# EAGLE design Front MCN Breakout (EAGLE 5.12)
PARTNO: RC0603JR-1010KL

## Sheet 1 of 3
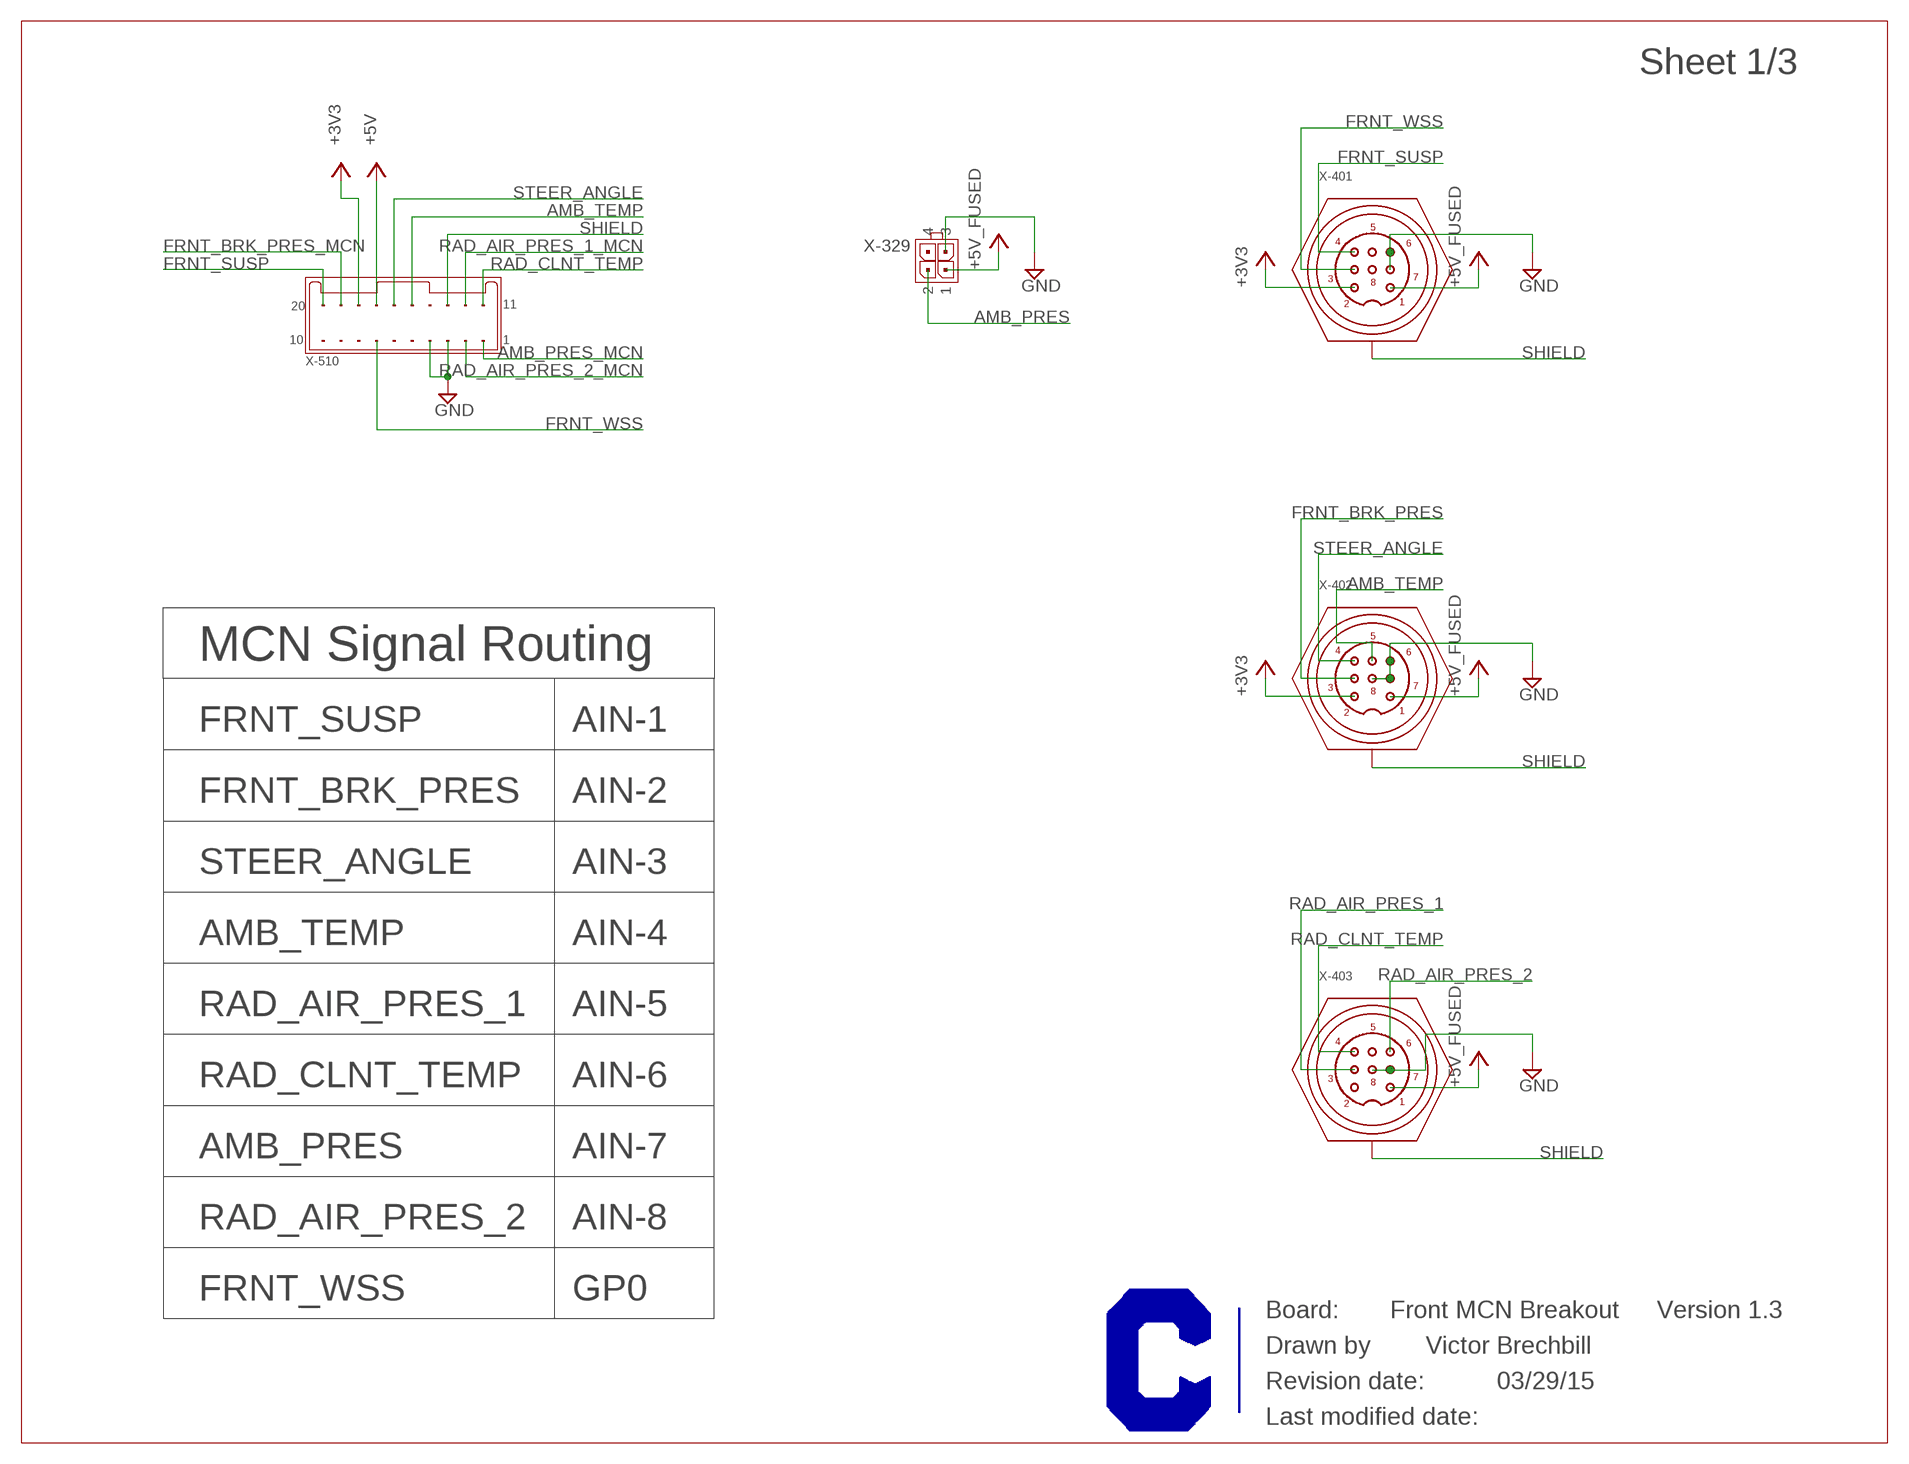
[diagram p0: schematic, sheet 1]

### Parts
U$1  CURRENT-C-LETTER-LANDSCAPE  [BLANK]
X-329  MICROFIT-04-DUAL-VERT-SMD  [MICROFIT-4-DUAL-VERT-SMD]
X-401  M8-8  [M8-VERT-8POS]
X-402  M8-8  [M8-VERT-8POS]
X-403  M8-8  [M8-VERT-8POS]
X-510  MICROCLASP-20-DUAL-RA  [MICROCLASP-20-DUAL-RA]

### Nets
+3V3: X-401.P$2 X-402.P$2 X-510.18 ; also sheet 2
+5V: X-510.17 ; also sheet 2
+5V_FUSED: X-329.1 X-401.P$1 X-402.P$1 X-403.P$1 ; also sheet 2
AMB_PRES: X-329.2 ; also sheet 2
AMB_PRES_MCN: X-510.1 ; also sheet 2
AMB_TEMP: X-402.P$5 X-510.15 ; also sheet 2
FRNT_BRK_PRES: X-402.P$3 ; also sheet 2
FRNT_BRK_PRES_MCN: X-510.19 ; also sheet 2
FRNT_SUSP: X-401.P$4 X-510.20
FRNT_WSS: X-401.P$3 X-510.7 ; also sheet 2
GND: X-329.3 X-401.P$6 X-401.P$7 X-402.P$6 X-402.P$7 X-402.P$8 X-403.P$7 X-403.P$8 X-510.3 X-510.4 ; also sheet 2
RAD_AIR_PRES_1: X-403.P$3 ; also sheet 2
RAD_AIR_PRES_1_MCN: X-510.12 ; also sheet 2
RAD_AIR_PRES_2: X-403.P$6 ; also sheet 2
RAD_AIR_PRES_2_MCN: X-510.2 ; also sheet 2
RAD_CLNT_TEMP: X-403.P$4 X-510.11 ; also sheet 2
SHIELD: X-401.SHLD(SHIELD) X-402.SHLD(SHIELD) X-403.SHLD(SHIELD) X-510.13
STEER_ANGLE: X-402.P$4 X-510.16
Unconnected: X-329.4 X-401.P$5 X-401.P$8 X-403.P$2 X-403.P$5 X-510.5 X-510.6 X-510.8 X-510.9 X-510.10 X-510.14

### Notes on the sheet
- MCN Signal Routing
- FRNT_SUSP | AIN-1
- FRNT_BRK_PRES | AIN-2
- STEER_ANGLE | AIN-3
- AMB_TEMP | AIN-4
- RAD_AIR_PRES_1 | AIN-5
- RAD_CLNT_TEMP | AIN-6
- AMB_PRES | AIN-7
- RAD_AIR_PRES_2 | AIN-8
- FRNT_WSS | GP0
- Front MCN Breakout | Version 1.3
- Victor Brechbill
- 03/29/15

## Sheet 2 of 3
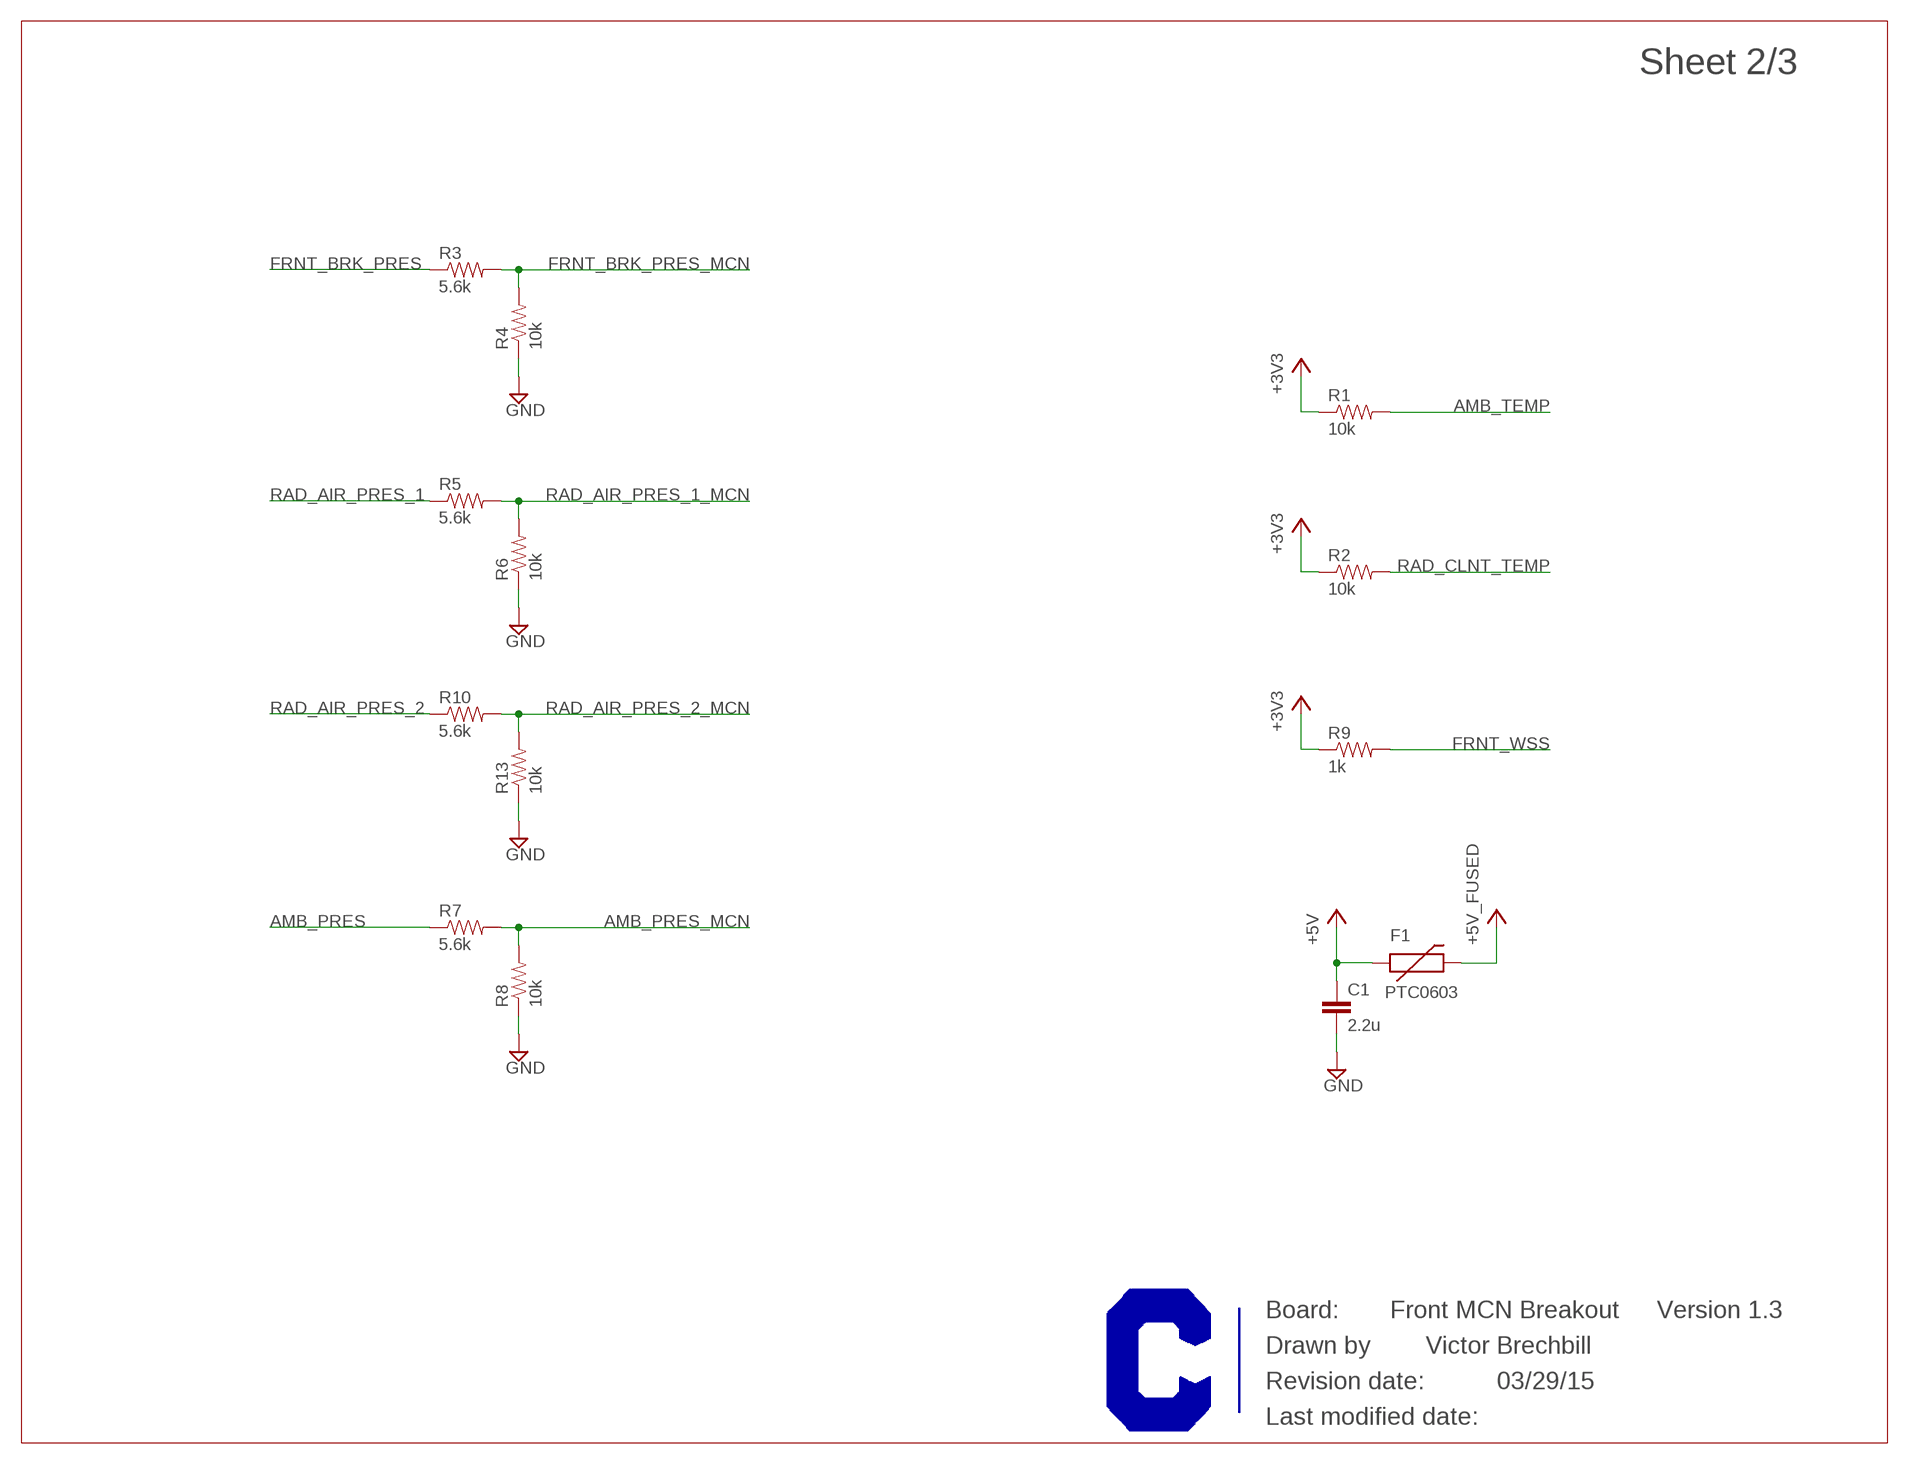
[diagram p1: schematic, sheet 2]

### Parts
C1  2.2u  CAP0603-CAP  [0603-CAP]
F1  PTC0603  [0603]
R1  10k  RESISTOR0603-RES  [0603-RES]
R2  10k  RESISTOR0603-RES  [0603-RES]
R3  5.6k  RESISTOR0603-RES  [0603-RES]
R4  10k  RESISTOR0603-RES  [0603-RES]
R5  5.6k  RESISTOR0603-RES  [0603-RES]
R6  10k  RESISTOR0603-RES  [0603-RES]
R7  5.6k  RESISTOR0603-RES  [0603-RES]
R8  10k  RESISTOR0603-RES  [0603-RES]
R9  1k  RESISTOR0603-RES  [0603-RES]
R10  5.6k  RESISTOR0603-RES  [0603-RES]
R13  10k  RESISTOR0603-RES  [0603-RES]
U$2  CURRENT-C-LETTER-LANDSCAPE  [BLANK]

### Nets
+3V3: R1.1 R2.1 R9.1 ; also sheet 1
+5V: C1.1 F1.1 ; also sheet 1
+5V_FUSED: F1.2 ; also sheet 1
AMB_PRES: R7.1 ; also sheet 1
AMB_PRES_MCN: R7.2 R8.2 ; also sheet 1
AMB_TEMP: R1.2 ; also sheet 1
FRNT_BRK_PRES: R3.1 ; also sheet 1
FRNT_BRK_PRES_MCN: R3.2 R4.2 ; also sheet 1
FRNT_WSS: R9.2 ; also sheet 1
GND: C1.2 R4.1 R6.1 R8.1 R13.1 ; also sheet 1
RAD_AIR_PRES_1: R5.1 ; also sheet 1
RAD_AIR_PRES_1_MCN: R5.2 R6.2 ; also sheet 1
RAD_AIR_PRES_2: R10.1 ; also sheet 1
RAD_AIR_PRES_2_MCN: R10.2 R13.2 ; also sheet 1
RAD_CLNT_TEMP: R2.2 ; also sheet 1

### Notes on the sheet
- Front MCN Breakout | Version 1.3
- Victor Brechbill
- 03/29/15

## Sheet 3 of 3
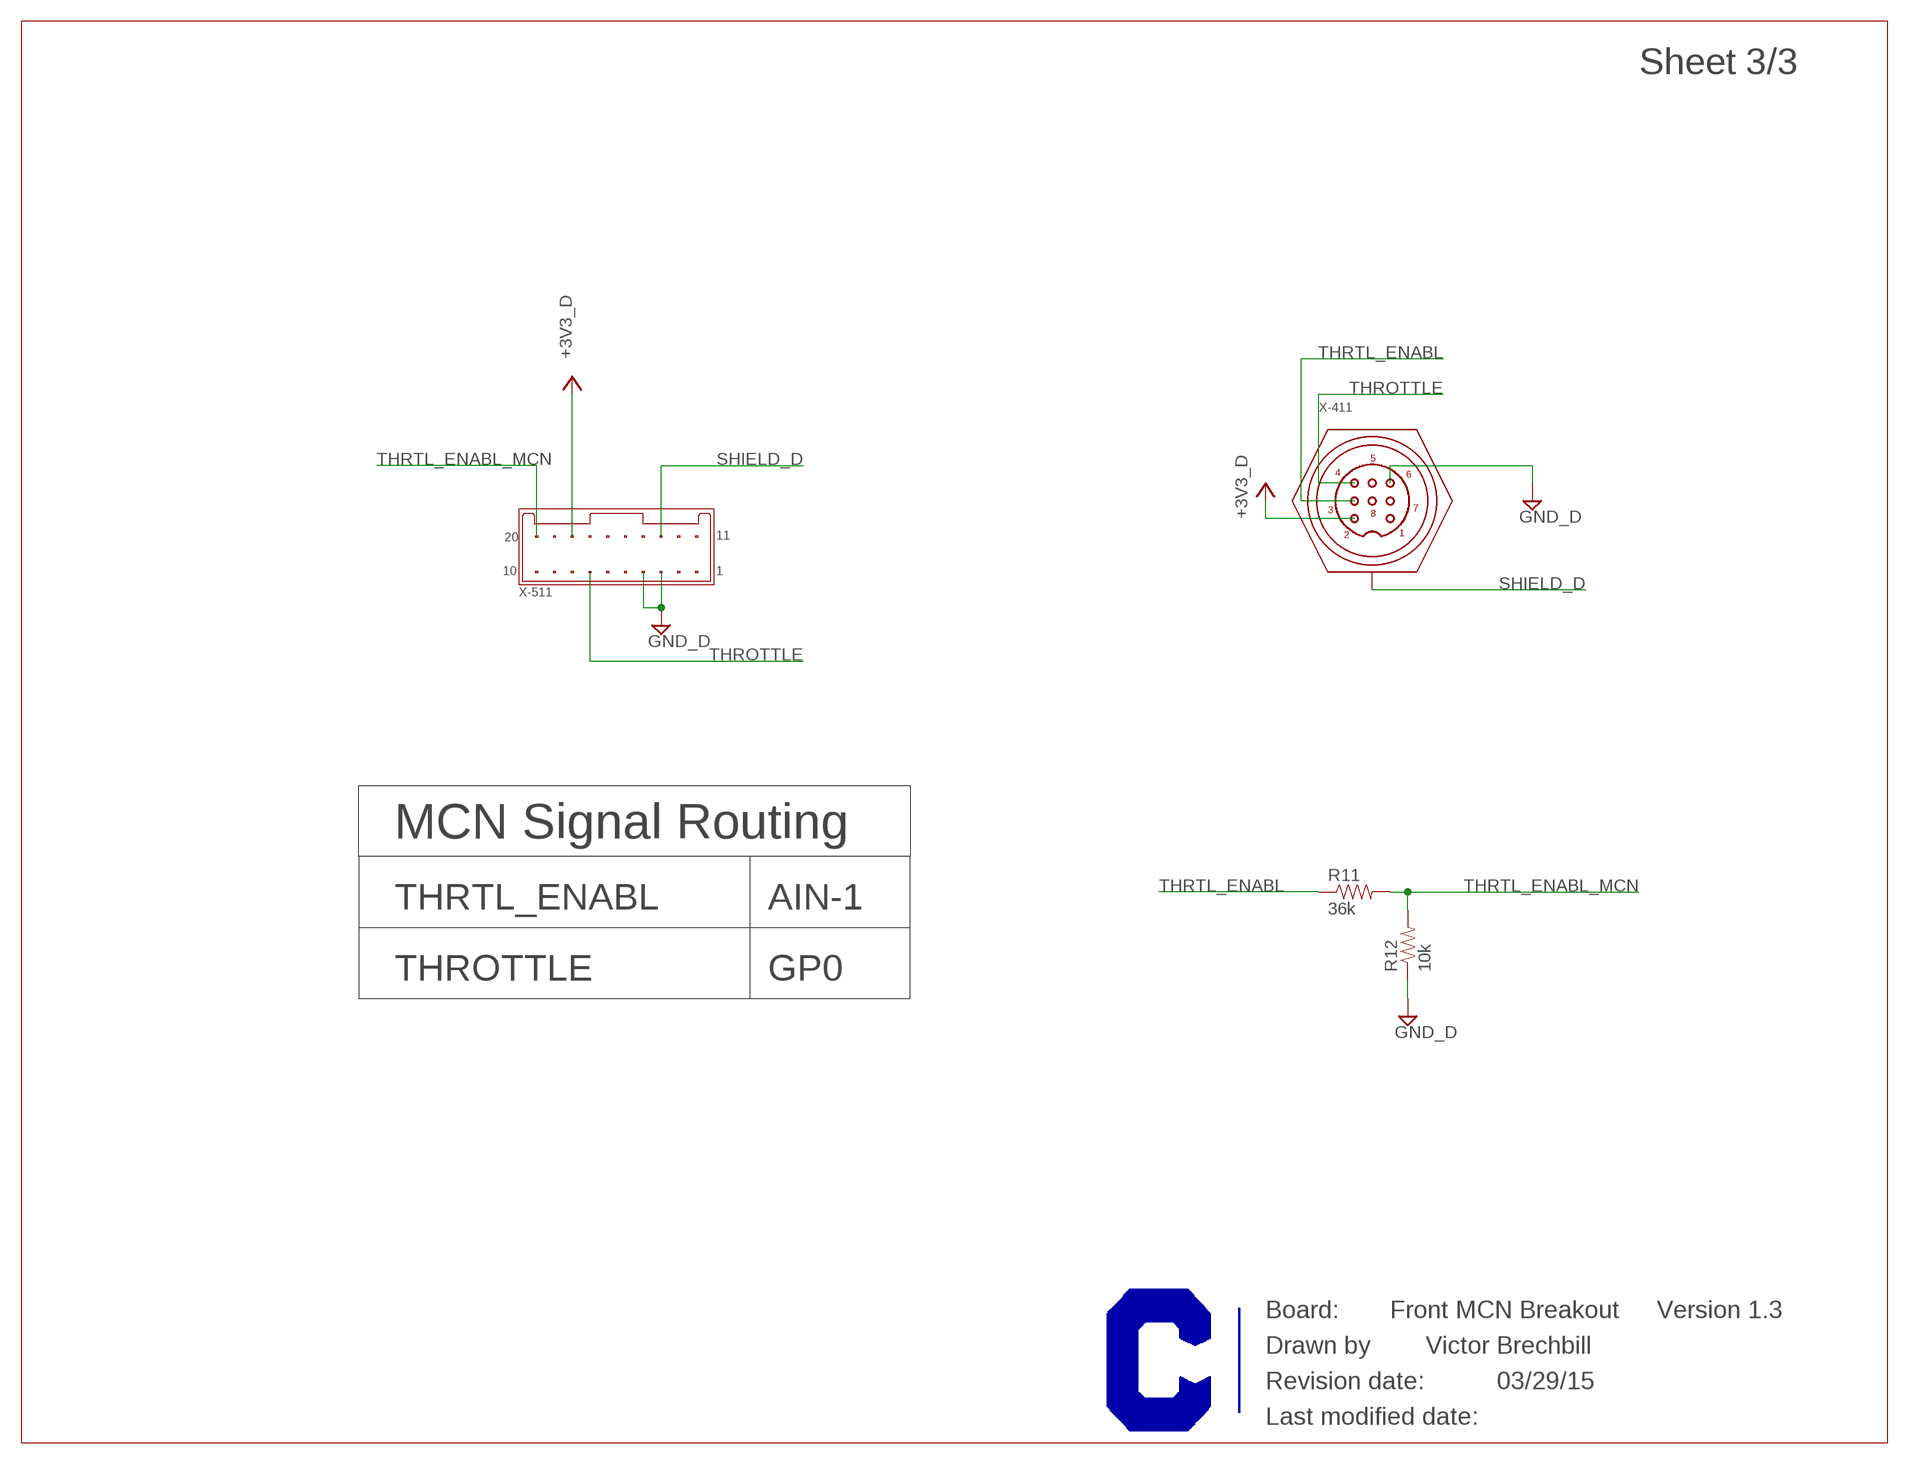
[diagram p2: schematic, sheet 3]

### Parts
R11  36k  RESISTOR0603-RES  [0603-RES]
R12  10k  RESISTOR0603-RES  [0603-RES]
U$3  CURRENT-C-LETTER-LANDSCAPE  [BLANK]
X-411  M8-8  [M8-VERT-8POS]
X-511  MICROCLASP-20-DUAL-RA  [MICROCLASP-20-DUAL-RA]

### Nets
+3V3_D: X-411.P$2 X-511.18
GND_D: R12.1 X-411.P$6 X-511.3 X-511.4
SHIELD_D: X-411.SHLD(SHIELD) X-511.13
THROTTLE: X-411.P$4 X-511.7
THRTL_ENABL: R11.1 X-411.P$3
THRTL_ENABL_MCN: R11.2 R12.2 X-511.20
Unconnected: X-411.P$1 X-411.P$5 X-411.P$7 X-411.P$8 X-511.1 X-511.2 X-511.5 X-511.6 X-511.8 X-511.9 X-511.10 X-511.11 X-511.12 X-511.14 X-511.15 X-511.16 X-511.17 X-511.19

### Notes on the sheet
- MCN Signal Routing
- THRTL_ENABL | AIN-1
- THROTTLE | GP0
- Front MCN Breakout | Version 1.3
- Victor Brechbill
- 03/29/15

## Library data of the parts
C1 = SparkFun:CAP: Capacitor Standard 0603 ceramic capacitor, and 0.1" leaded capacitor.
F1 = SparkFun:PTC: Resettable Fuse PTC Resettable Fuse. Spark Fun Electronics SKU : COM-08357
R1-R13 = SparkFun:RESISTOR: Resistor Basic schematic elements and footprints for 0603, 1206, and PTH resistors.
U$1-U$3 = Frames:CURRENT-C-LETTER-LANDSCAPE; BOM: EXCLUDE
X-329 = Molex:MICROFIT-04-DUAL: Molex MicroFit 3.00mm Pitch Header, Surface Mount, Dual Row, 4 Circuits Molex P/N: 43045-0609 (vert) Drawing: http://www.molex.com/pdm_docs/sd/430450418_sd.pdf (vert) Information: http://www.molex.com/molex/products/datasheet.jsp?part=active/0430450418_PCB_HEADERS.xml (vert)
X-401-X-403 X-411 = Conec:M8-8
X-510 X-511 = Molex:MICROCLASP-20-DUAL

## Board
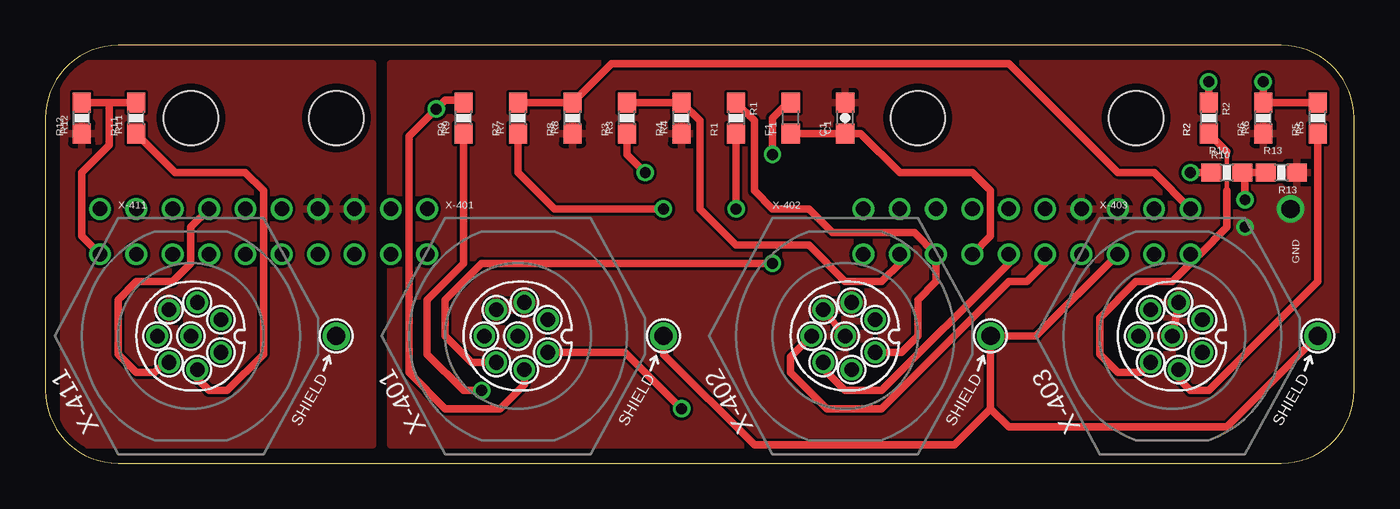
[diagram p3: board, top side]
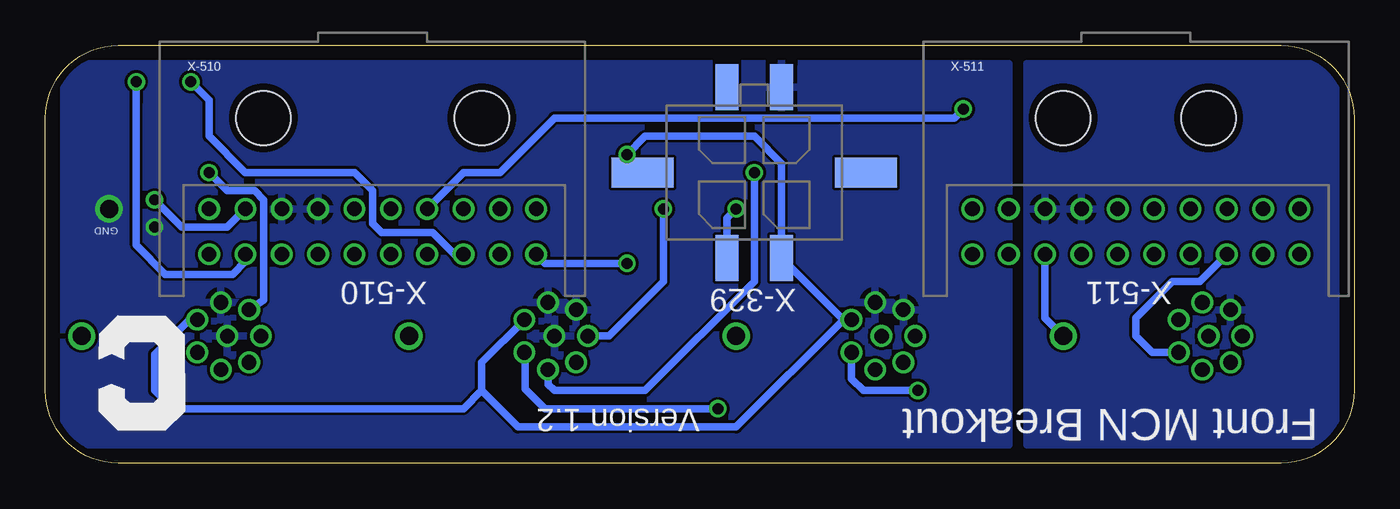
[diagram p4: board, bottom side, seen from below]

Size 72 x 23 mm. Coordinates in mm from the lower left corner, seen from the top.
Outline: 68,0 arc90 72,4 72,19 arc90 68,23 4,23 arc90 0,19 0,4 arc90 4,0 68,0
Copper layers (1*16): Top 0.0356mm / dielectric 1.5011mm / Bottom 0.0356mm
Design rules "OSH Park 2-layer": minimum track width 6mil, minimum drill 13mil, track to track 6mil, track to pad 6mil, pad to pad 6mil, via to via 6mil, smd to smd 6mil, copper to edge 15mil, drill to drill 6mil, minimum pad ring 7mil, minimum via ring 7mil, stop-mask expansion 4mil, vias tented up to drill 25mil, thermal gap 10mil
Holes 3 mm at 60,19 48,19 8,19 16,19

### Footprints (pad centres in the part's own frame; a part is rotated, then mirrored left to right if it is on the bottom)
0603-CAP = smd 1.1 x 1: 1 -0.85,0; 2 0.85,0
0603 = smd 1.1 x 1: 1 -0.85,0; 2 0.85,0
0603-RES = smd 1.1 x 1: 1 -0.85,0; 2 0.85,0
MICROFIT-4-DUAL-VERT-SMD = smd 1.27 x 2.54: 1 1.5,-4.699; 2 -1.5,-4.699; 3 1.5,4.699; 4 -1.5,4.699 | smd 3.43 x 1.65: 5 6.147,0; 6 -6.147,0
M8-VERT-8POS = drill 0.8 round: P$1 1.65,0.9; P$2 1.65,-0.9; P$3 0.35,-1.85; P$4 -1.2,-1.45; P$5 -1.85,0; P$6 -1.2,1.45; P$7 0.35,1.85; P$8 0,0 | drill 1 round: SHLD 8,0
MICROCLASP-20-DUAL-RA = drill 0.8 round: 1 -9,0; 2 -7,0; 3 -5,0; 4 -3,0; 5 -1,0; 6 1,0; 7 3,0; 8 5,0; 9 7,0; 10 9,0; 11 -9,-2.5; 12 -7,-2.5; 13 -5,-2.5; 14 -3,-2.5; 15 -1,-2.5; 16 1,-2.5; 17 3,-2.5; 18 5,-2.5; 19 7,-2.5; 20 9,-2.5

### Placement (x,y rotation side)
C1  44,19 90 top
F1  41,19 90 top
R1  38,19 270 top
R2  64,19 270 top
R3  32,19 90 top
R4  35,19 90 top
R5  70,19 90 top
R6  67,19 90 top
R7  26,19 90 top
R8  29,19 90 top
R9  23,19 90 top
R10  65,16 0 top
R11  5,19 90 top
R12  2,19 90 top
R13  68,16 180 top
U$1  -41.91,63.5 0 top  (outside the outline)
U$2  -44.45,63.5 0 top  (outside the outline)
U$3  -45,0 0 top  (outside the outline)
X-329  33,16 0 bottom
X-401  26,7 0 top
X-402  44,7 0 top
X-403  62,7 0 top
X-411  8,7 0 top
X-510  54,14 0 bottom
X-511  12,14 0 bottom

### Tracks (layer width: path | path; a pad name or v marks a point on that pad's centre or on a via)
+3V3  (via drill 0.6)
  Top 0.406: v64,21 R2.1 | X-402.P$2 47.1,6.1 48,7 48,9 49,10 X-510.18 47.8,12.7 43.3,12.7 42,14 40,14 39,15 39,18.85 R1.1 | X-401.P$2 31.9,6.1 v35,3 | R9.1 23,11 21,9 21,6 23,4 v24,4
  Bottom 0.406: X-510.18 49.5,11.5 50.7,12.7 53.5,12.7 54,13.2 54,15 55,16 61,16 63,18 63,20 v64,21 | v35,3 44.5,3 45.6,4.1 45.6,6.05 X-402.P$2 | v24,4 27,4 27.65,4.65 X-401.P$2
+3V3_D
  Bottom 0.406: X-511.18 8.5,10 10,10 12,8 12,7 11.1,6.1 X-411.P$2
+5V
  Top 0.406: F1.1 C1.1 44.85,18.15 47,16 51,16 52,15 52,12.5 X-510.17
+5V_FUSED  (via drill 0.6)
  Top 0.406: F1.2 40.85,19.85 40,19 v40,17
  Bottom 0.406: X-403.P$1 64.1,7.9 66,6 66,4 65,3 49,3 48,4 | 48,4 46,2 34,2 28.1,7.9 X-401.P$1 28.1,7.9 X-329.1 31.5,16.5 33,18 39,18 v40,17 | 48,4 48,5.55 X-402.P$1
AMB_PRES  (via drill 0.6)
  Top 0.406: v34,14 28,14 26,16 R7.1
  Bottom 0.406: X-329.2 34.5,13.5 v34,14
AMB_PRES_MCN
  Top 0.406: R7.2 R8.2 31.15,22 53,22 59,16 61,16 X-510.1
AMB_TEMP  (via drill 0.6)
  Top 0.406: X-510.15 55,11 54,10 53,10 46,3 43,3 41,5 41,5.85 X-402.P$5 42,7 | 38,18 R1.2 v38,14
  Bottom 0.406: v38,14 38,10 41,7 X-402.P$5
FRNT_BRK_PRES  (via drill 0.6)
  Top 0.406: R3.1 32,17 v33,16
  Bottom 0.406: X-402.P$3 44.35,4.35 44,4 39,4 33,10 v33,16
FRNT_BRK_PRES_MCN
  Top 0.406: R3.2 R4.2 36,18.85 36,14 38,12 42,12 44,10 46,10 47,11 X-510.19
FRNT_SUSP  (via drill 0.6)
  Top 0.406: X-401.P$4 23.45,5.55 22,7 22,9 24,11 v40,11
  Bottom 0.406: v40,11 44.5,11 X-510.20
FRNT_WSS  (via drill 0.6)
  Top 0.406: X-401.P$3 26.35,4.35 25,3 22,3 20,5 20,18 v21.5,19.5 22,20 22.85,20 R9.2
  Bottom 0.406: X-510.7 49,16 47,16 44,19 22,19 v21.5,19.5
GND  (via drill 0.6, 1)
  Top 0.406: X-402.P$6 X-402.P$8 | X-403.P$8 X-403.P$7
  other vias: 68.5,14 66,13
  pour Bottom: 19,22 71,22 71,1 19,1
  pour Top: 19,22 71,22 71,1 19,1
GND_D
  pour Bottom: 18,22 18,1 1,1 1,22
  pour Top: 1,22 18,22 18,1 1,1
RAD_AIR_PRES_1
  Top 0.406: R5.1 70,10 64,4 63,4 62.35,4.65 X-403.P$3
RAD_AIR_PRES_1_MCN  (via drill 0.6)
  Top 0.406: R5.2 R6.2 v67,21
  Bottom 0.406: R6.2 v67,21 67,12 65.4,10.4 61.7,10.4 61,11.1 X-510.12
RAD_AIR_PRES_2  (via drill 0.6)
  Top 0.406: v63,16 R10.1
  Bottom 0.406: v63,16 62,15 60.5,15 60,14.5 60,9 X-403.P$6
RAD_AIR_PRES_2_MCN  (via drill 0.6)
  Top 0.406: R13.2 R10.2 66,15.85 v66,14.5
  Bottom 0.406: X-510.2 62,13 64.5,13 v66,14.5
RAD_CLNT_TEMP
  Top 0.254: 65,15 65,17.15
  Top 0.406: 65,17.15 R2.2 | X-403.P$4 60.25,5 59,5 58,6 58,8 60,10 62,10 63,11 X-510.11 63.5,11.5 65,13 65,15
SHIELD
  Top 0.406: X-401.SHLD 34,6 39,1 50,1 52,3 | 52,3 53,2 65,2 X-403.SHLD | 52,3 X-402.SHLD 54.5,7 X-510.13
SHIELD_D
  Bottom 0.406: X-411.SHLD 17,8 X-511.13
STEER_ANGLE
  Top 0.406: X-510.16 53,11 46,4 44,4 42.8,5.2 X-402.P$4
THROTTLE
  Top 0.406: X-511.7 8,13 8,11 7,10 5,10 4,9 4,6 5,5 6,5 6.55,5.55 X-411.P$4
THRTL_ENABL
  Top 0.406: R11.1 7.15,16 11,16 12,15 12,6 10,4 9,4 8.35,4.65 X-411.P$3
THRTL_ENABL_MCN
  Top 0.406: 3.5,19.85 R12.2 | 3.5,19.85 R11.2 | X-511.20 2,12.5 2,16 3.5,17.5 3.5,19.85

### Text on the board
_tsilk: R12 | R11 | R9 | R7 | R8 | R3 | R4 | R1 | F1 | C1 | R2 | R2 | R6 | R5 | R10 | R13 | GND | X-411 | X-401 | X-402 | X-403
_bsilk: GND | X-511 | X-329 | X-510 | Front MCN Breakout | Version 1.2